# EAGLE design esquema (EAGLE 9.6.2)
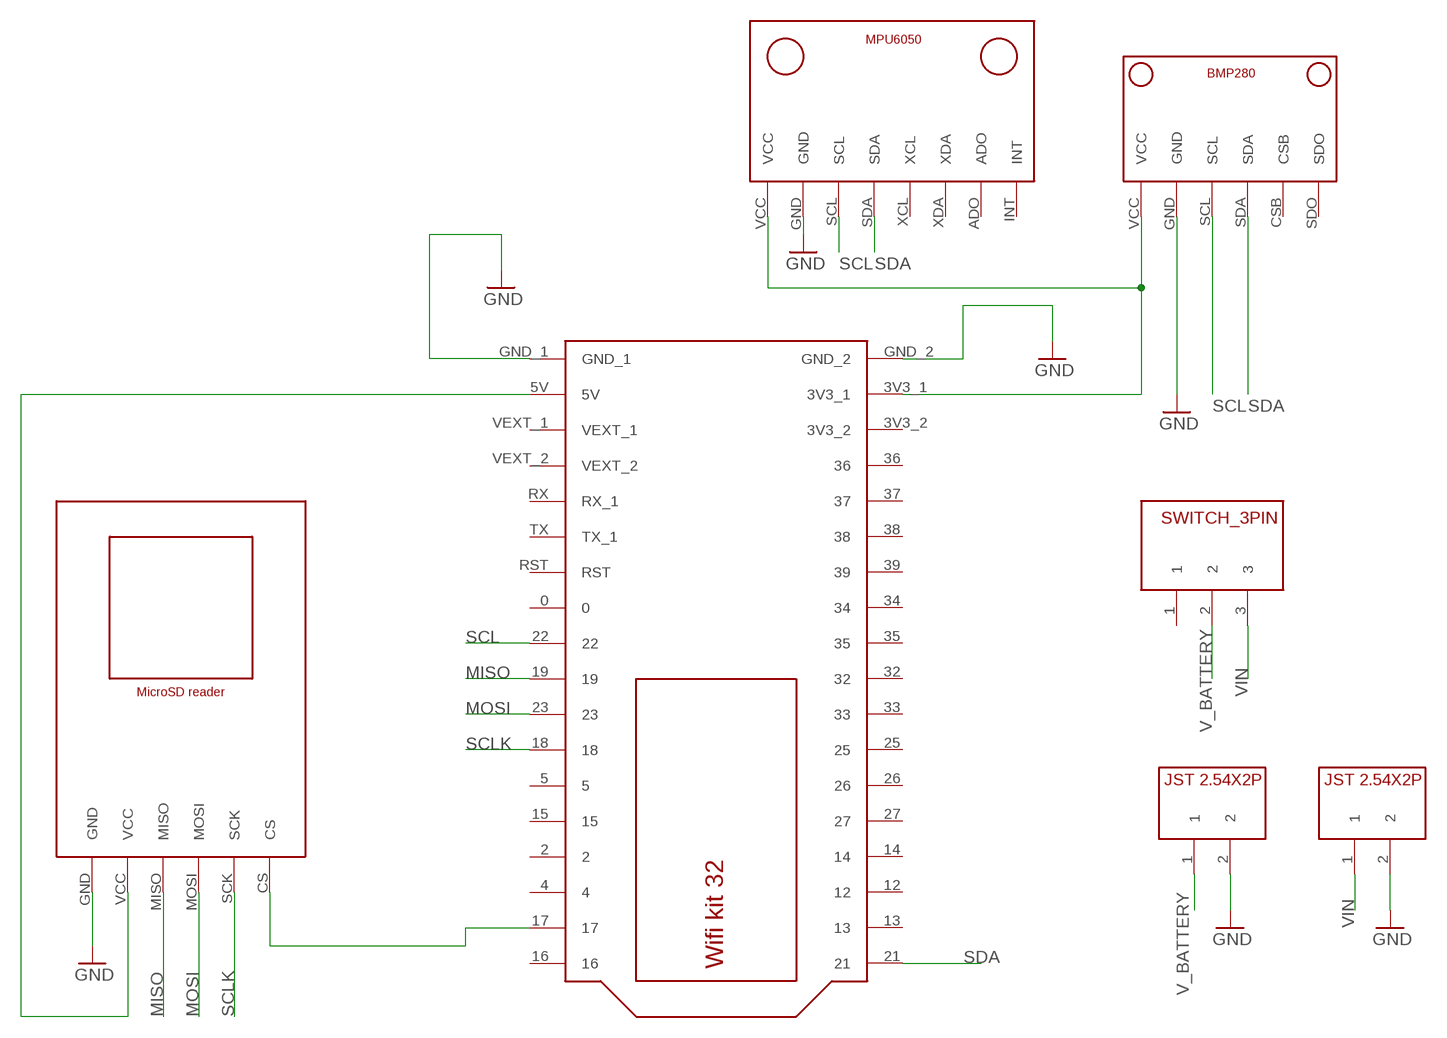
[diagram p0: schematic, sheet 1]

## Parts
U$1  BMP280V1  [BMP280_FOOTPRINT]
U$2  MICROSD_READER  [MICROSD_READER_FOOTPRINT]
U$3  MPU6050V1  [MPU6050_FOOTPRINT]
U$4  WIFI_KIT32  [WIFI_KIT32]
U$5  JST2.54X2P  [JST2.54X2P_FOOTPRINT]
U$6  SWITCH_3PIN  [SWITCH_3PIN]
U$7  JST2.54X2P  [JST2.54X2P_FOOTPRINT]

## Nets
GND: U$1.GND U$2.GND U$3.GND U$4.GND_1 U$4.GND_2 U$5.2 U$7.2
MISO: U$2.MISO U$4.19
MOSI: U$2.MOSI U$4.23
N$1: U$2.CS U$4.17
N$4: U$1.VCC U$3.VCC U$4.3V3_1
N$7: U$2.VCC U$4.5V
SCL: U$1.SCL U$3.SCL U$4.22
SCLK: U$2.SCK U$4.18
SDA: U$1.SDA U$3.SDA U$4.21
V_BATTERY: U$5.1 U$6.2
VIN: U$6.3 U$7.1
Unconnected: U$1.CSB U$1.SDO U$3.ADO U$3.INT U$3.XCL U$3.XDA U$4.0 U$4.2 U$4.3V3_2 U$4.4 U$4.5 U$4.12 U$4.13 U$4.14 U$4.15 U$4.16 U$4.25 U$4.26 U$4.27 U$4.32 U$4.33 U$4.34 U$4.35 U$4.36 U$4.37 U$4.38 U$4.39 U$4.RST U$4.RX(RX_1) U$4.TX(TX_1) U$4.VEXT_1 U$4.VEXT_2 U$6.1

## Library data of the parts
U$1 = CRD:BMP280: Sensor barométrico
U$2 = CRD:MICROSD_READER: Leitor e gravador de cartão SD
U$3 = CRD:MPU6050: Acelerômetro e Giroscópio
U$4 = CRD:WIFI_KIT32: Placa de desenvolvimento ESP32 da Heltech
U$5 U$7 = CRD:JST2.54X2P: Conector JST 2 pinos (2.54mm de distância entre pinos)
U$6 = CRD:SWITCH_3PIN

## Board
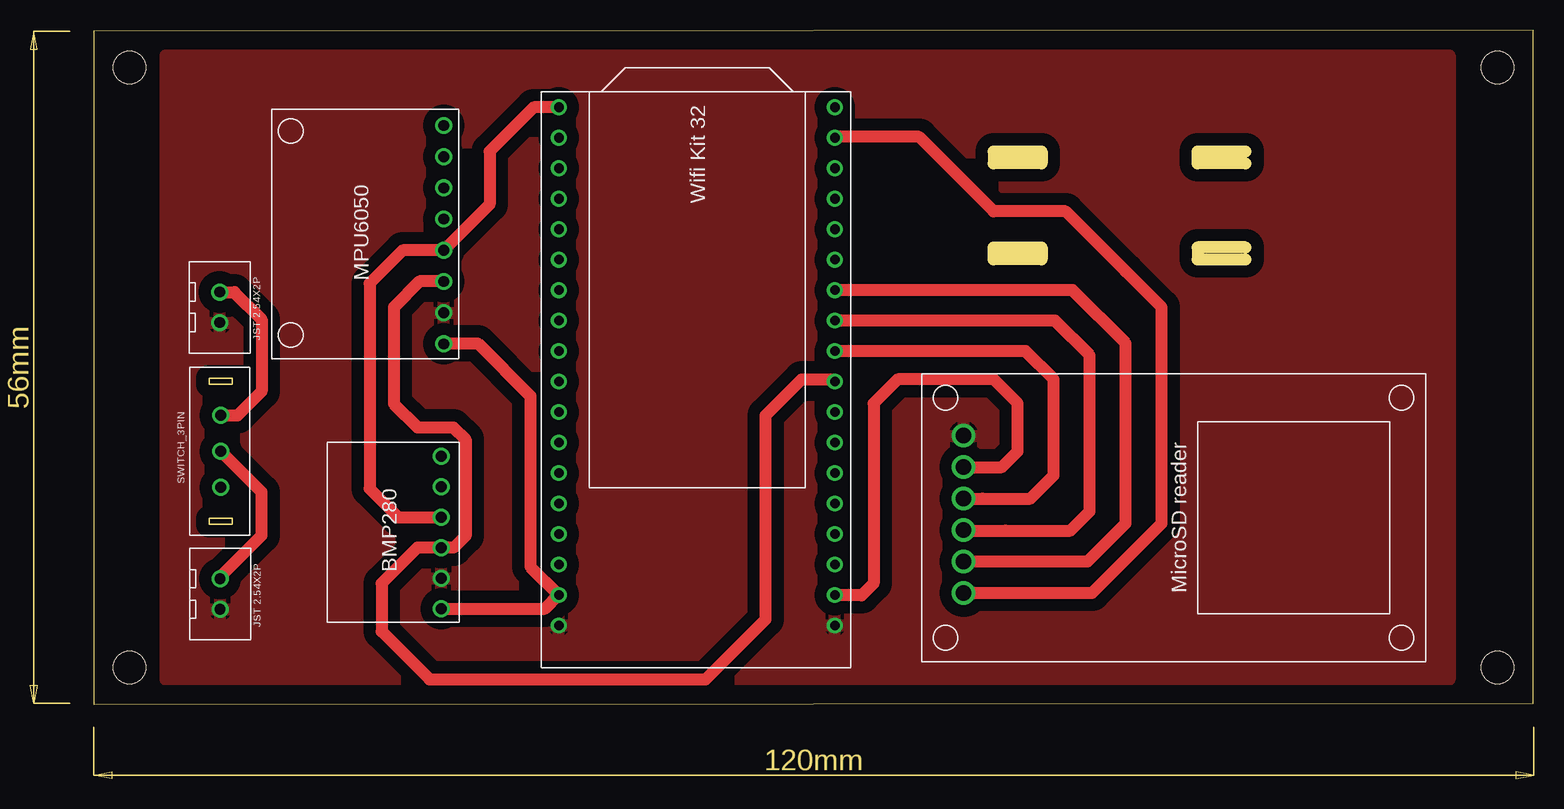
[diagram p1: board, top side]

Size 119.97 x 56.19 mm. Coordinates in mm from the lower left corner, seen from the top.
Outline: 0,0 119.97,0.1 119.97,56.19 0,56.09 0,0
Outline: 75,46.08 79,46.08 79,45.08 75,45.08 75,46.08
Outline: 79,38.08 79,37.08 75,37.08 75,38.08 79,38.08
Outline: 92,46.08 96,46.08 96,45.08 92,45.08 92,46.08
Outline: 92,38.08 92,37.08 96,37.08 96,38.08 92,38.08
Copper layers (1*16): Top 0.035mm / dielectric 1.5mm / Bottom 0.035mm
Design rules "default *": minimum track width 1mm, minimum drill 0.35mm, track to track 40mil, track to pad 0.5mm, pad to pad 6mil, via to via 6mil, smd to smd 6mil, copper to edge 40mil, drill to drill 6mil, minimum pad ring 10mil, minimum via ring 8mil, stop-mask expansion 4mil, vias tented up to drill 0mil, thermal gap 10mil
Holes 2.7 mm at 3,53.08 3,3.08 117,3.08 117,53.08

### Footprints (pad centres in the part's own frame; a part is rotated, then mirrored left to right if it is on the bottom)
BMP280_FOOTPRINT = drill 0.891: CSB 3.686,-6.12; GND -3.934,-6.12; SCL -1.395,-6.12; SDA 1.145,-6.12; SDO 6.226,-6.12; VCC -6.474,-6.12
MICROSD_READER_FOOTPRINT = drill 1.3: CS 6.195,-14.534; GND -6.905,-14.534; MISO -1.665,-14.534; MOSI 0.955,-14.534; SCK 3.575,-14.534; VCC -4.285,-14.534
MPU6050_FOOTPRINT = drill 0.891: ADO 6.686,-10.184; GND -6.314,-10.184; INT 9.286,-10.184; SCL -3.715,-10.184; SDA -1.115,-10.184; VCC -8.915,-10.184; XCL 1.486,-10.184; XDA 4.085,-10.184
WIFI_KIT32 = drill 0.8: 0 -11.77,12.73; 2 -11.77,-5.05; 3V3_1 11.23,27.97; 3V3_2 11.23,25.43; 4 -11.77,-7.59; 5 -11.77,0.03; 5V -11.77,27.97; 12 11.23,-7.59; 13 11.23,-10.13; 14 11.23,-5.05; 15 -11.77,-2.51; 16 -11.77,-12.67; 17 -11.77,-10.13; 18 -11.77,2.57; 19 -11.77,7.65; 21 11.23,-12.67; 22 -11.77,10.19; 23 -11.77,5.11; 25 11.23,2.57; 26 11.23,0.03; 27 11.23,-2.51; 32 11.23,7.65; 33 11.23,5.11; 34 11.23,12.73; 35 11.23,10.19; 36 11.23,22.89; 37 11.23,20.35; 38 11.23,17.81; 39 11.23,15.27; GND_1 -11.77,30.51; GND_2 11.23,30.51; RST -11.77,15.27; RX -11.77,20.35; TX -11.77,17.81; VEXT_1 -11.77,25.43; VEXT_2 -11.77,22.89
JST2.54X2P_FOOTPRINT = drill 0.9: 1 -1.27,0; 2 1.27,0
SWITCH_3PIN = drill 0.93: 1 -3,-1.6; 2 0,-1.6; 3 3,-1.6

### Placement (x,y rotation side)
U$1  22.85,14.44 90 top
U$2  87.04,15.48 270 top
U$3  19,38.95 90 top
U$4  50,37.08 180 top
U$5  10.54,9.19 270 top
U$6  9,21.08 90 top
U$7  10.5,33.08 270 top

### Tracks (layer width: path | path; a pad name or v marks a point on that pad's centre or on a via)
GND
  pour Top: 6,54.08 113,54.08 113,47.08 113,2.08 112,2.08 6,2.08
MISO
  Top 1: U$4.19 73,29.43 77.65,29.43 80,27.08 80,19.08 78.06,17.14 74.06,17.14 U$2.MISO
MOSI
  Top 1: U$4.23 75,31.97 80.11,31.97 83,29.08 83,16.08 81.4,14.48 76,14.48 72.55,14.48 U$2.MOSI
N$1
  Top 1: U$4.17 61.84,47.28 68.8,47.28 75,41.08 81,41.08 86,36.08 89,33.08 89,15.08 83.2,9.29 80.2,9.29 U$2.CS
N$4
  Top 1: U$1.VCC 37.63,7.97 U$4.3V3_1 36.4,11.48 36.4,25.68 32,30.08 29.23,30.08 U$3.VCC
N$7
  Top 1: U$4.5V 61.8,9.08 64,9.08 65,10.08 65,25.08 67,27.08 75,27.08 77,25.08 77,21.08 75.69,19.76 U$2.VCC
SCL
  Top 1: U$4.22 61.58,27.08 59,27.08 56,24.08 56,7.08 51,2.08 28,2.08 24,6.08 24,10.08 27,13.08 27.04,13.05 U$1.SCL 30,13.05 30.99,14.04 30.99,22.07 29.98,23.08 27,23.08 25.02,25.06 25.02,33.1 27.16,35.24 U$3.SCL
SCLK
  Top 1: U$4.18 76,34.51 77,34.51 81.57,34.51 86,30.08 86,15.08 82.83,11.9 78,11.9 U$2.SCK
SDA
  Top 1: U$1.SDA 25.4,15.58 23,17.98 23,35.08 25.76,37.84 U$3.SDA 33,41.65 33,46.08 36.67,49.75 U$4.21
V_BATTERY
  Top 1: U$5.1 10.67,10.75 14,14.08 14,17.68 U$6.2
VIN
  Top 1: U$6.3 12,24.08 14,26.08 14,32.08 11.73,34.35 U$7.1